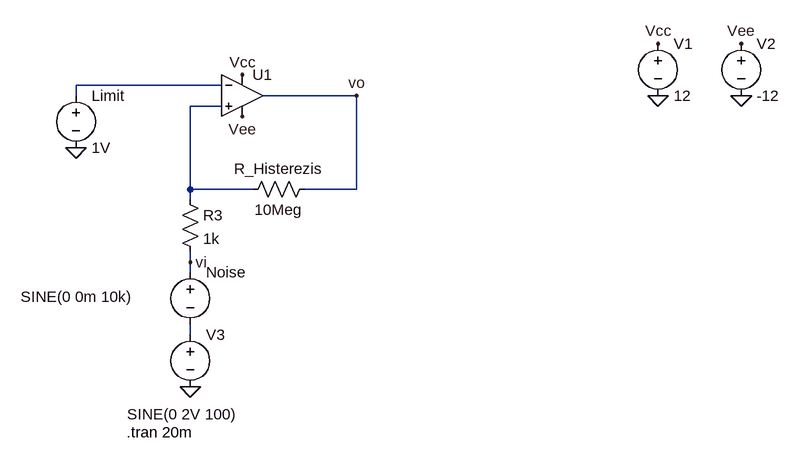
[diagram p0: schematic comparator.asc]
comparator.asc, the LTspice schematic file:
Version 4
SHEET 1 964 680
WIRE 96 112 -128 112
WIRE -128 128 -128 112
WIRE 304 128 160 128
WIRE 96 144 48 144
WIRE 48 272 48 144
WIRE 144 272 48 272
WIRE 304 272 304 128
WIRE 304 272 224 272
WIRE 48 288 48 272
WIRE 48 384 48 368
WIRE 48 400 48 384
WIRE 48 496 48 480
FLAG 768 128 0
FLAG 768 48 Vcc
FLAG 896 128 0
FLAG 896 48 Vee
FLAG 128 96 Vcc
FLAG 128 160 Vee
FLAG 304 128 vo
FLAG 48 576 0
FLAG 48 384 vi
FLAG -128 208 0
SYMBOL voltage 768 32 R0
WINDOW 123 0 0 Left 0
WINDOW 39 0 0 Left 0
SYMATTR InstName V1
SYMATTR Value 12
SYMBOL voltage 896 32 R0
WINDOW 123 0 0 Left 0
WINDOW 39 0 0 Left 0
SYMATTR InstName V2
SYMATTR Value -12
SYMBOL res 32 272 R0
SYMATTR InstName R3
SYMATTR Value 1k
SYMBOL voltage 48 480 R0
WINDOW 3 -97 138 Left 2
WINDOW 123 0 0 Left 0
WINDOW 39 0 0 Left 0
SYMATTR InstName V3
SYMATTR Value SINE(0 2V 100)
SYMBOL Opamps\\UniversalOpamp2 128 128 R0
SYMATTR InstName U1
SYMBOL voltage -128 112 R0
WINDOW 123 0 0 Left 0
WINDOW 39 0 0 Left 0
SYMATTR InstName Limit
SYMATTR Value 1V
SYMBOL voltage 48 384 R0
WINDOW 3 -261 53 Left 2
WINDOW 123 0 0 Left 0
WINDOW 39 0 0 Left 0
SYMATTR InstName Noise
SYMATTR Value SINE(0 0m 10k)
SYMBOL res 240 256 R90
WINDOW 0 0 56 VBottom 2
WINDOW 3 32 56 VTop 2
SYMATTR InstName R_Histerezis
SYMATTR Value 10Meg
TEXT -50 646 Left 2 !.tran 20m

The netlist it stands for:
* comparator.asc
V1 Vcc 0 12
V2 Vee 0 -12
R3 N002 vi 1k
V3 N003 0 SINE(0 2V 100)
XU1 N002 N001 Vcc Vee vo level.2 Avol=1Meg GBW=10Meg Slew=10Meg ilimit=25m rail=0 Vos=0 phimargin=45 en=0 enk=0 in=0 ink=0 Rin=500Meg  ; pins IN+ IN- V+ V- OUT
V§Limit N001 0 1V
V§Noise vi N003 SINE(0 0m 10k)
R_Histerezis vo N002 10Meg
.tran 20m
.lib UniversalOpamps2.sub
.backanno
.end